# EAGLE design v0.4 (EAGLE 9.3.2)
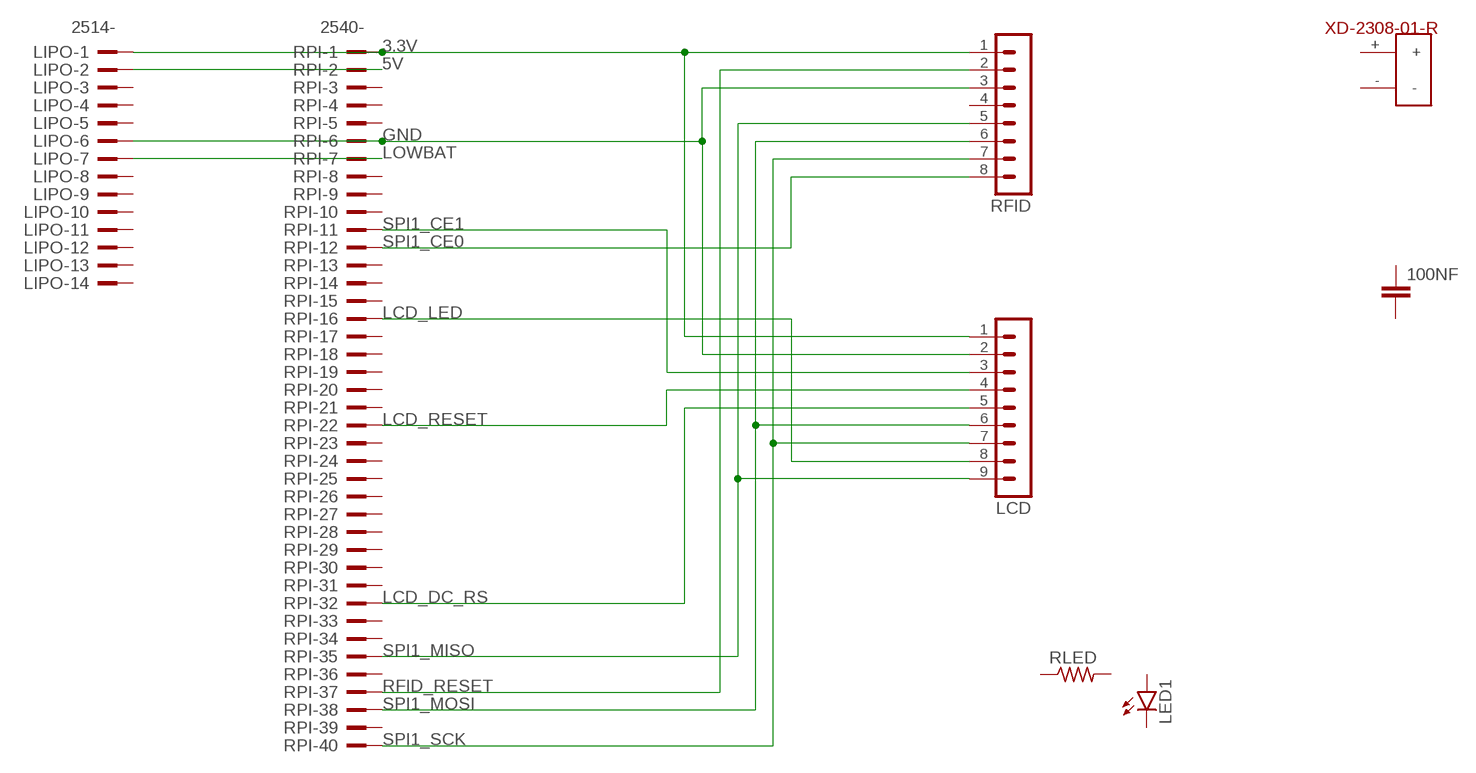
[diagram p0: schematic, sheet 1]

## Parts
100NF  C-EU025-025X050  [C025-025X050]
LCD  MA09-1  [MA09-1]
LED1  LED3MM  [LED3MM]
LIPO  2514-  [PAK100/2500-14]
RFID  MA08-1  [MA08-1]
RLED  R-US_0204/5  [0204/5]
RPI  2540-  [PAK100/2500-40]
U$1  XD-2308-01-R  [XD-2308-01-R]

## Nets
3.3V: LCD.1 LIPO.1 RFID.1 RPI.1
5V: LIPO.2 RPI.2
GND: LCD.2 LIPO.6 RFID.3 RPI.6
LCD_DC_RS: LCD.5 RPI.32
LCD_LED: LCD.8 RPI.16
LCD_RESET: LCD.4 RPI.22
LOWBAT: LIPO.7 RPI.7
RFID_RESET: RFID.2 RPI.37
SPI1_CE0: RFID.8 RPI.12
SPI1_CE1: LCD.3 RPI.11
SPI1_MISO: LCD.9 RFID.5 RPI.35
SPI1_MOSI: LCD.6 RFID.6 RPI.38
SPI1_SCK: LCD.7 RFID.7 RPI.40
Unconnected: 100NF.1 100NF.2 LED1.A LED1.K(C) LIPO.3 LIPO.4 LIPO.5 LIPO.8 LIPO.9 LIPO.10 LIPO.11 LIPO.12 LIPO.13 LIPO.14 RFID.4 RLED.1 RLED.2 RPI.3 RPI.4 RPI.5 RPI.8 RPI.9 RPI.10 RPI.13 RPI.14 RPI.15 RPI.17 RPI.18 RPI.19 RPI.20 RPI.21 RPI.23 RPI.24 RPI.25 RPI.26 RPI.27 RPI.28 RPI.29 RPI.30 RPI.31 RPI.33 RPI.34 RPI.36 RPI.39 U$1.+ U$1.-

## Library data of the parts
100NF = rcl:C-EU: CAPACITOR, European symbol; SPICEPREFIX: C
LCD = con-lstb:MA09-1: PIN HEADER; OC_FARNELL: unknown; OC_NEWARK: unknown
LED1 = led:LED: LED OSRAM: - CHIPLED LG R971, LG N971, LY N971, LG Q971, LY Q971, LO R971, LY R971 LH N974, LH R974 LS Q976, LO Q976, LY Q976 LO Q996 - Hyper CHIPLED LW Q18S LB Q993, LB Q99A, LB R99A - SideLED LS A670, LO A670, LY A670, LG A670, LP A670 LB A673, LV A673, LT A673, LW A673 LH A674 LY A675 LS A676, LA A676, LO A676, LY A676, LW A676 LS A679, LY A679, LG A679 - Hyper Micro SIDELED® LS Y876, LA Y876, LO Y876, LY Y876 LT Y87S - SmartLED LW L88C, LW L88S LB L89C, LB L89S, LG L890 LS L89K, LO L89K, LY L89K LS L896, LA L896, LO L896, LY L896 - TOPLED LS T670, LO T670, LY T670, LG T670, LP T670 LSG T670, LSP T670, LSY T670, LOP T670, LYG T670 LG T671, LOG T671, LSG T671 LB T673, LV T673, LT T673, LW T673 LH T674 LS T676, LA T676, LO T676, LY T676, LB T676, LH T676, LSB T676, LW T676 LB T67C, LV T67C, LT T67C, LS T67K, LO T67K, LY T67K, LW E67C LS E67B, LA E67B, LO E67B, LY E67B, LB E67C, LV E67C, LT E67C LW T67C LS T679, LY T679, LG T679 LS T770, LO T770, LY T770, LG T770, LP T770 LB T773, LV T773, LT T773, LW T773 LH T774 LS E675, LA E675, LY E675, LS T675 LS T776, LA T776, LO T776, LY T776, LB T776 LHGB T686 LT T68C, LB T68C - Hyper Mini TOPLED® LB M676 - Mini TOPLED Santana® LG M470 LS M47K, LO M47K, LY M47K Source: http://www.osram.convergy.de LUXEON: - LUMILED® LXK2-PW12-R00, LXK2-PW12-S00, LXK2-PW14-U00, LXK2-PW14-V00 LXK2-PM12-R00, LXK2-PM12-S00, LXK2-PM14-U00 LXK2-PE12-Q00, LXK2-PE12-R00, LXK2-PE12-S00, LXK2-PE14-T00, LXK2-PE14-U00 LXK2-PB12-K00, LXK2-PB12-L00, LXK2-PB12-M00, LXK2-PB14-N00, LXK2-PB14-P00, LXK2-PB14-Q00 LXK2-PR12-L00, LXK2-PR12-M00, LXK2-PR14-Q00, LXK2-PR14-R00 LXK2-PD12-Q00, LXK2-PD12-R00, LXK2-PD12-S00 LXK2-PH12-R00, LXK2-PH12-S00 LXK2-PL12-P00, LXK2-PL12-Q00, LXK2-PL12-R00 Source: www.luxeon.com KINGBRIGHT: KA-3528ASYC Source: www.kingbright.com
LIPO = con-3m:2514-: 3M (TM) Pak 100 4-Wall Header Source: 3M; OC_FARNELL: unknown; OC_NEWARK: unknown
RFID = con-lstb:MA08-1: PIN HEADER; OC_FARNELL: unknown; OC_NEWARK: unknown
RLED = rcl:R-US_: RESISTOR, American symbol; SPICEPREFIX: R
RPI = con-3m:2540-: 3M (TM) Pak 100 4-Wall Header Source: 3M; OC_FARNELL: unknown; OC_NEWARK: unknown
U$1 = XD-2308-01-R speaker:XD-2308-01-R: XD-2308-01-R PCB mount speaker from aliexpress aliexpress link <https://www.aliexpress.com/item/2pcs-lot-New-PCB-Mount-Mini-Speaker-0-5W-8R-YZ2308-8-ohms-0-5-watt/32922953183.html?spm=a2g0s.9042311.0.0.1e9d4c4d9GI7Tx>

## Board
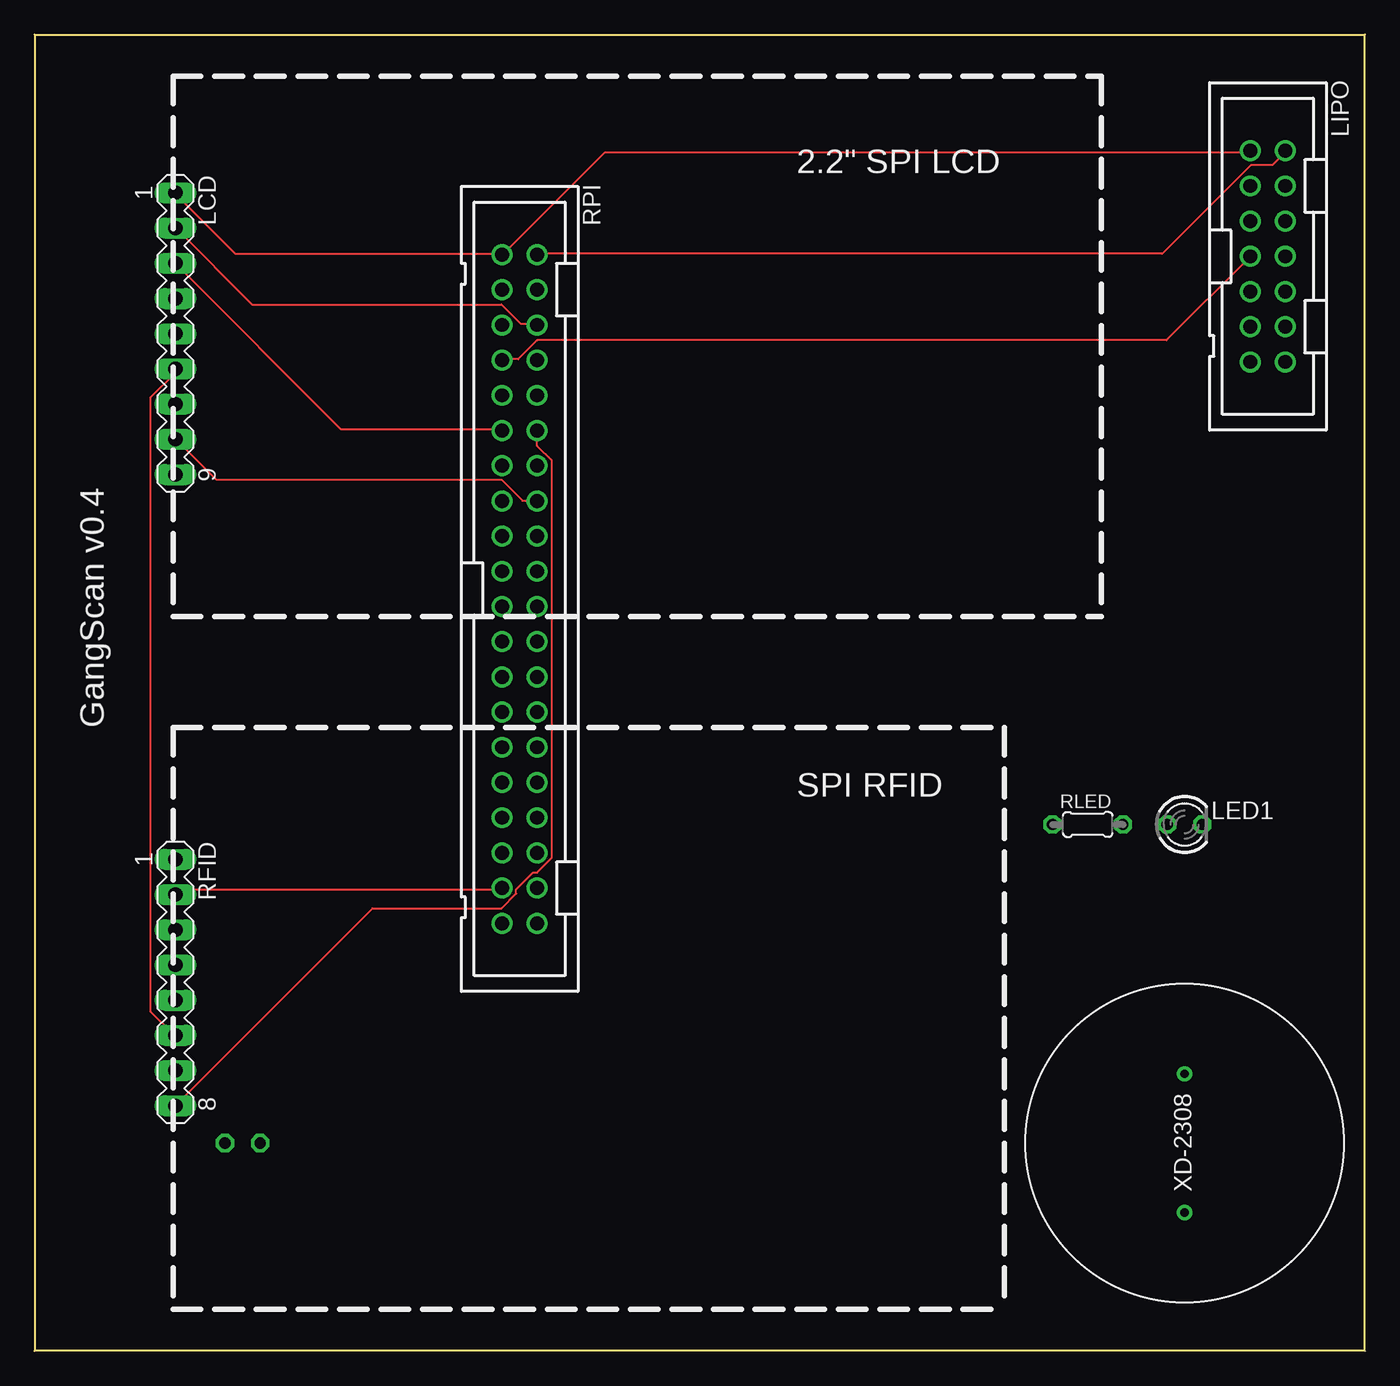
[diagram p1: board, top side]
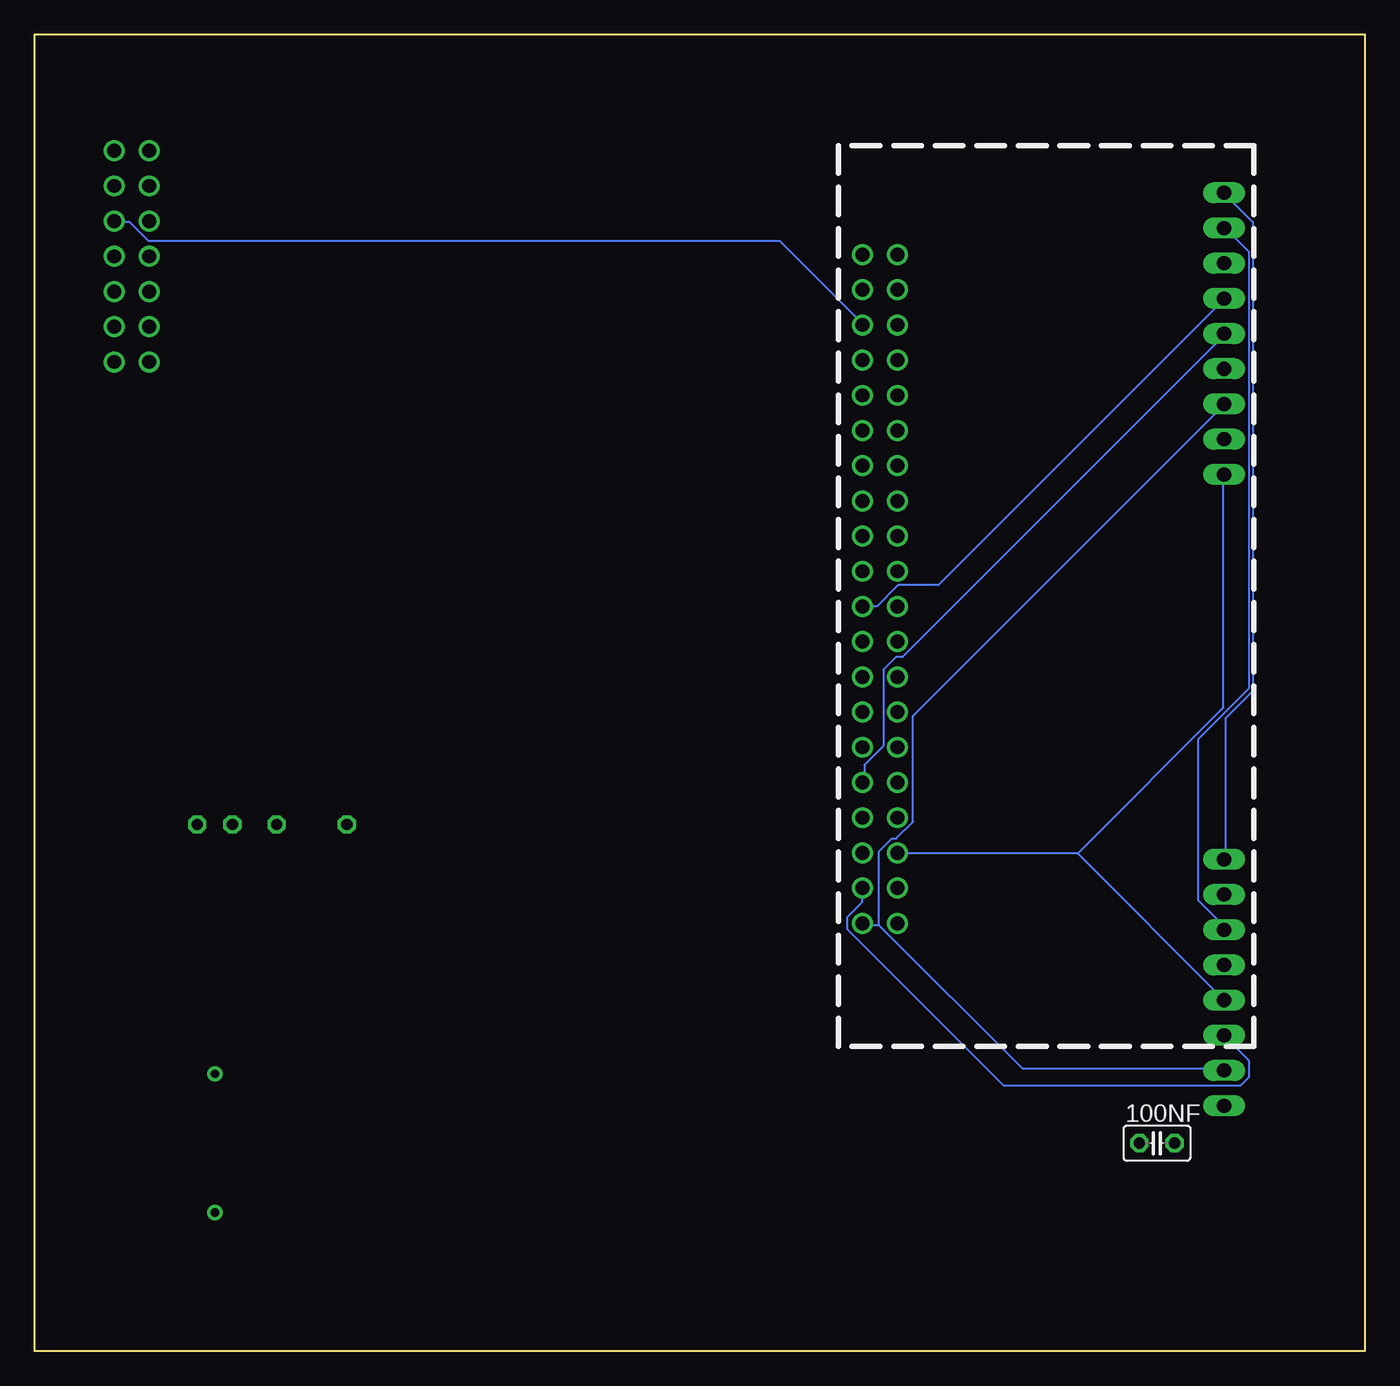
[diagram p2: board, bottom side, seen from below]

Size 96 x 95 mm. Coordinates in mm from the lower left corner, seen from the top.
Outline: 0,95 96,95 96,0 0,0 0,95
Copper layers (1*16): Top 0.035mm / dielectric 1.5mm / Bottom 0.035mm
Design rules "default": minimum track width 6mil, minimum drill 0.35mm, track to track 6mil, track to pad 6mil, pad to pad 6mil, via to via 6mil, smd to smd 6mil, copper to edge 40mil, drill to drill 6mil, minimum pad ring 10mil, minimum via ring 8mil, stop-mask expansion 4mil, vias tented up to drill 0mil, thermal gap 10mil

### Footprints (pad centres in the part's own frame; a part is rotated, then mirrored left to right if it is on the bottom)
C025-025X050 = drill 0.813 octagon: 1 -1.27,0; 2 1.27,0
MA09-1 = drill 1.016 long: 1 -10.16,0; 2 -7.62,0; 3 -5.08,0; 4 -2.54,0; 5 0,0; 6 2.54,0; 7 5.08,0; 8 7.62,0; 9 10.16,0
LED3MM = drill 0.813 octagon: A -1.27,0; K 1.27,0
PAK100/2500-14 = drill 1 pad 1.422: 1 -7.62,-1.27; 2 -7.62,1.27; 3 -5.08,-1.27; 4 -5.08,1.27; 5 -2.54,-1.27; 6 -2.54,1.27; 7 0,-1.27; 8 0,1.27; 9 2.54,-1.27; 10 2.54,1.27; 11 5.08,-1.27; 12 5.08,1.27; 13 7.62,-1.27; 14 7.62,1.27
MA08-1 = drill 1.016 long: 1 -8.89,0; 2 -6.35,0; 3 -3.81,0; 4 -1.27,0; 5 1.27,0; 6 3.81,0; 7 6.35,0; 8 8.89,0
0204/5 = drill 0.813 octagon: 1 -2.54,0; 2 2.54,0
PAK100/2500-40 = drill 1 pad 1.422: 1 -24.13,-1.27; 2 -24.13,1.27; 3 -21.59,-1.27; 4 -21.59,1.27; 5 -19.05,-1.27; 6 -19.05,1.27; 7 -16.51,-1.27; 8 -16.51,1.27; 9 -13.97,-1.27; 10 -13.97,1.27; 11 -11.43,-1.27; 12 -11.43,1.27; 13 -8.89,-1.27; 14 -8.89,1.27; 15 -6.35,-1.27; 16 -6.35,1.27; 17 -3.81,-1.27; 18 -3.81,1.27; 19 -1.27,-1.27; 20 -1.27,1.27; 21 1.27,-1.27; 22 1.27,1.27; 23 3.81,-1.27; 24 3.81,1.27; 25 6.35,-1.27; 26 6.35,1.27; 27 8.89,-1.27; 28 8.89,1.27; 29 11.43,-1.27; 30 11.43,1.27; 31 13.97,-1.27; 32 13.97,1.27; 33 16.51,-1.27; 34 16.51,1.27; 35 19.05,-1.27; 36 19.05,1.27; 37 21.59,-1.27; 38 21.59,1.27; 39 24.13,-1.27; 40 24.13,1.27
XD-2308-01-R = drill 0.6: + 0,0; - 10,0

### Placement (x,y rotation side)
100NF  15,15 0 bottom
LCD  10.16,73.42 270 top
LED1  83,38 0 top
LIPO  89,79 270 top
RFID  10.16,26.59 270 top
RLED  76,38 0 top
RPI  35,55 270 top
U$1  83,10 90 top

### Tracks (layer width: path | path; a pad name or v marks a point on that pad's centre or on a via)
3.3V
  Top 0.152: LCD.1 10.21,83.46 14.48,79.19 33.68,79.19 RPI.1 33.83,79.19 41.15,86.5 87.63,86.5 LIPO.1
  Bottom 0.152: RFID.1 10.06,35.6 10.06,45.66 8.08,47.64 8.08,81.48 10.06,83.46 LCD.1
5V
  Top 0.152: RPI.2 36.27,79.19 81.38,79.19 87.78,85.59 89.31,85.59 90.22,86.5 LIPO.2
GND
  Top 0.152: RPI.6 36.12,74.16 35.05,74.16 33.68,75.53 15.7,75.53 10.21,81.02 LCD.2
  Bottom 0.152: LIPO.6 90.22,81.48 89.15,81.48 87.78,80.1 42.22,80.1 36.27,74.16 RPI.6 | RFID.3 10.21,30.42 10.21,30.73 12.04,32.55 12.04,44.14 8.38,47.8 8.38,79.34 10.06,81.02 LCD.2
LCD_DC_RS
  Bottom 0.152: RPI.32 36.12,41.09 36.12,42.31 34.75,43.68 34.75,49.17 33.83,50.08 33.38,50.08 10.06,73.4 LCD.5
LCD_LED
  Top 0.152: RPI.16 36.12,61.36 35.2,61.36 33.68,62.88 13.11,62.88 10.21,65.78 LCD.8
LCD_RESET
  Bottom 0.152: RPI.22 36.12,53.74 35.2,53.74 33.68,55.26 30.79,55.26 10.21,75.84 LCD.4
LOWBAT
  Top 0.152: RPI.7 33.83,71.57 34.9,71.57 36.27,72.94 81.69,72.94 87.63,78.89 LIPO.7
RFID_RESET
  Top 0.152: RPI.37 33.68,33.32 10.52,33.32 10.21,33.01 RFID.2
SPI1_CE0
  Top 0.152: RPI.12 36.27,66.39 36.27,65.32 37.34,64.25 37.34,35.6 36.27,34.54 35.97,34.54 34.75,33.32 34.75,33.01 33.68,31.95 24.38,31.95 10.21,17.77 RFID.8
SPI1_CE1
  Top 0.152: RPI.11 33.68,66.54 22.1,66.54 10.21,78.43 LCD.3
SPI1_MISO
  Bottom 0.152: 20.73,35.91 33.68,35.91 RPI.35 | 20.73,35.91 10.21,25.39 RFID.5 | 20.73,35.91 10.21,46.42 10.21,63.19 LCD.9
SPI1_MOSI
  Top 0.152: LCD.6 10.06,70.81 10.06,70.5 8.38,68.83 8.38,24.48 10.06,22.8 RFID.6
  Bottom 0.152: RPI.38 36.27,33.32 36.27,32.4 37.34,31.34 37.34,30.42 26.06,19.14 8.99,19.14 8.38,19.75 8.38,20.97 10.06,22.65 RFID.6
SPI1_SCK
  Bottom 0.152: 35.05,30.73 36.12,30.73 RPI.40 | 35.05,30.73 24.69,20.36 10.21,20.36 RFID.7 | 35.05,30.73 35.05,36.06 34.14,36.98 33.83,36.98 32.61,38.19 32.61,45.81 10.21,68.22 LCD.7

### Text on the board
tPlace: 2.2" SPI LCD | GangScan v0.4 | SPI RFID